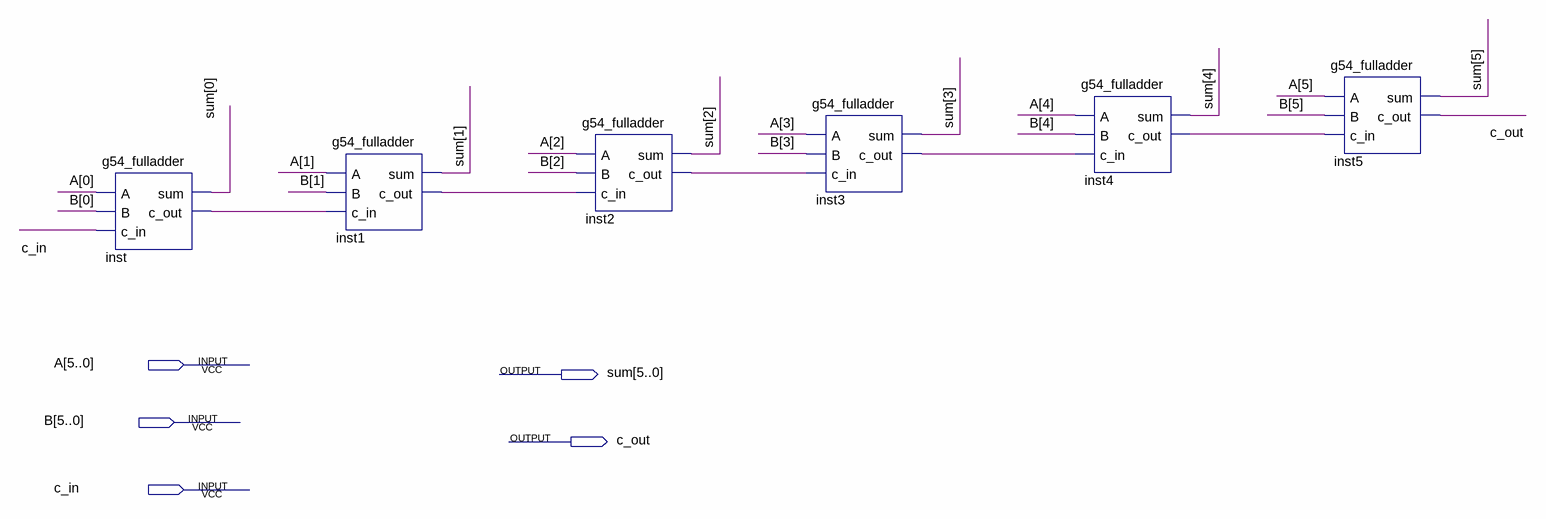
[diagram p0: schematic sheet]
// Quartus schematic g54_6bitadder.bdf as structural Verilog: 6 symbols, 5 pins
module g54_6bitadder (
  input  [5:0] A,
  input  [5:0] B,
  input  c_in,
  output [5:0] sum,
  output c_out
);

  wire inst1_c_out, inst2_c_out, inst3_c_out, inst4_c_out, inst_c_out;

  g54_fulladder inst (.A(A[0]), .B(B[0]), .c_in(c_in), .sum(sum[0]), .c_out(inst_c_out));
  g54_fulladder inst1 (.A(A[1]), .B(B[1]), .c_in(inst_c_out), .sum(sum[1]), .c_out(inst1_c_out));
  g54_fulladder inst2 (.A(A[2]), .B(B[2]), .c_in(inst1_c_out), .sum(sum[2]), .c_out(inst2_c_out));
  g54_fulladder inst3 (.A(A[3]), .B(B[3]), .c_in(inst2_c_out), .sum(sum[3]), .c_out(inst3_c_out));
  g54_fulladder inst4 (.A(A[4]), .B(B[4]), .c_in(inst3_c_out), .sum(sum[4]), .c_out(inst4_c_out));
  g54_fulladder inst5 (.A(A[5]), .B(B[5]), .c_in(inst4_c_out), .sum(sum[5]), .c_out(c_out));
endmodule
